# EAGLE design main_pcb (EAGLE 7.3.0)
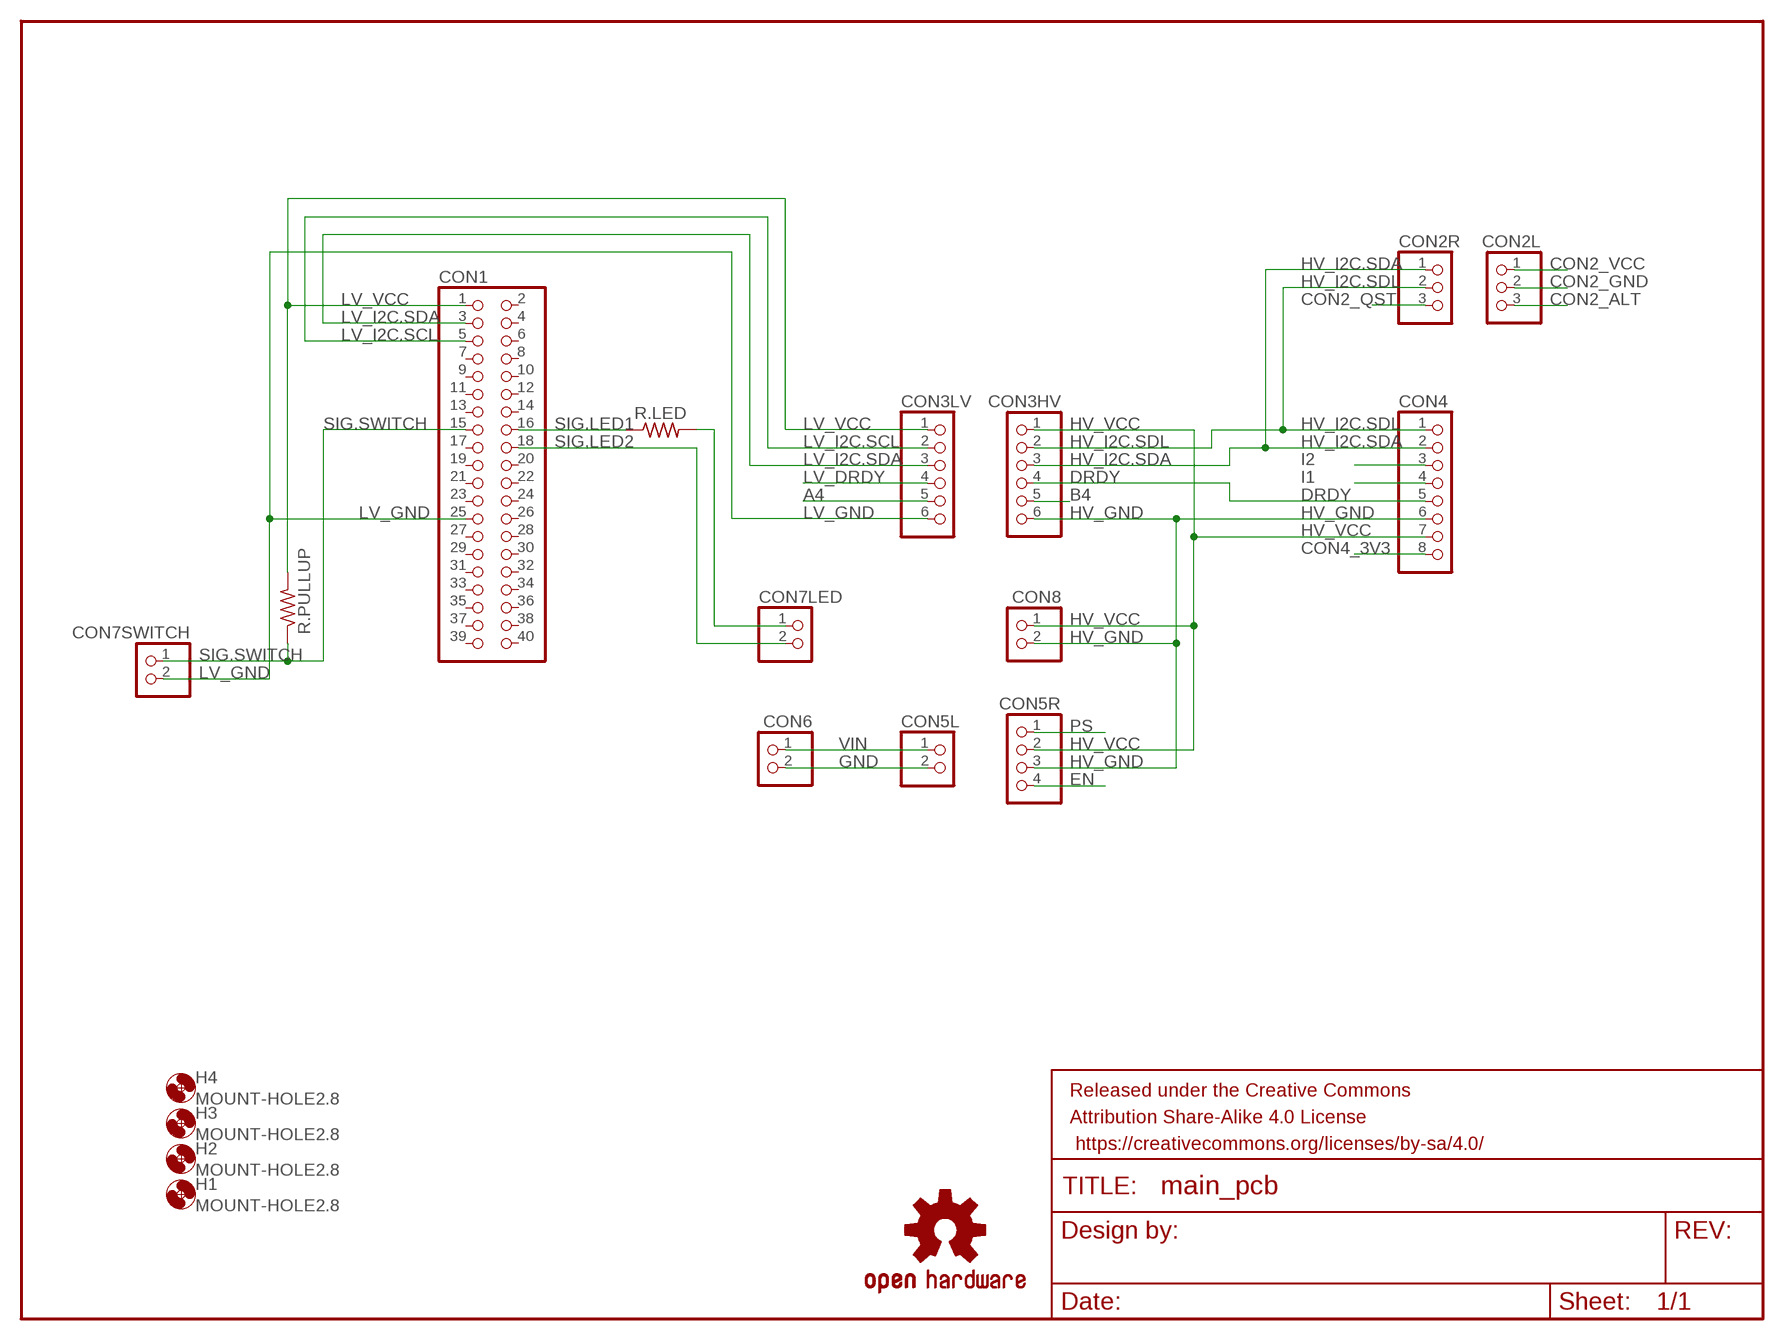
[diagram p0: schematic, sheet 1]

## Parts
CON1  PINHD-2X20  [2X20]
CON2L  PINHD-1X3  [1X03]
CON2R  PINHD-1X3  [1X03]
CON3HV  PINHD-1X6  [1X06]
CON3LV  PINHD-1X6  [1X06]
CON4  PINHD-1X8  [1X08]
CON5L  PINHD-1X2  [1X02]
CON5R  PINHD-1X4  [1X04]
CON6  PINHD-1X2  [1X02]
CON7LED  PINHD-1X2  [1X02]
CON7SWITCH  PINHD-1X2  [1X02]
CON8  PINHD-1X2  [1X02]
FRAME1  FRAME-LETTER  [CREATIVE_COMMONS]
H1  MOUNT-HOLE2.8  [2,8]
H2  MOUNT-HOLE2.8  [2,8]
H3  MOUNT-HOLE2.8  [2,8]
H4  MOUNT-HOLE2.8  [2,8]
LOGO1  OSHW-LOGOL  [OSHW-LOGO-L]
R.LED  R-US_0204/2V  [0204V]
R.PULLUP  R-US_0204/2V  [0204V]

## Nets
A4: CON3LV.5
B4: CON3HV.5
CON2_ALT: CON2L.3
CON2_GND: CON2L.2
CON2_QST: CON2R.3
CON2_VCC: CON2L.1
CON4_3V3: CON4.8
DRDY: CON3HV.4 CON4.5
EN: CON5R.4
GND: CON5L.2 CON6.2
HV_GND: CON3HV.6 CON4.6 CON5R.3 CON8.2
HV_I2C.SDA: CON2R.1 CON3HV.3 CON4.2
HV_I2C.SDL: CON2R.2 CON3HV.2 CON4.1
HV_VCC: CON3HV.1 CON4.7 CON5R.2 CON8.1
I1: CON4.4
I2: CON4.3
LV_DRDY: CON3LV.4
LV_GND: CON1.25 CON3LV.6 CON7SWITCH.2
LV_I2C.SCL: CON1.5 CON3LV.2
LV_I2C.SDA: CON1.3 CON3LV.3
LV_VCC: CON1.1 CON3LV.1 R.PULLUP.2
N$1: CON7LED.1 R.LED.2
PS: CON5R.1
SIG.LED1: CON1.16 R.LED.1
SIG.LED2: CON1.18 CON7LED.2
SIG.SWITCH: CON1.15 CON7SWITCH.1 R.PULLUP.1
VIN: CON5L.1 CON6.1
Unconnected: CON1.2 CON1.4 CON1.6 CON1.7 CON1.8 CON1.9 CON1.10 CON1.11 CON1.12 CON1.13 CON1.14 CON1.17 CON1.19 CON1.20 CON1.21 CON1.22 CON1.23 CON1.24 CON1.26 CON1.27 CON1.28 CON1.29 CON1.30 CON1.31 CON1.32 CON1.33 CON1.34 CON1.35 CON1.36 CON1.37 CON1.38 CON1.39 CON1.40

## Library data of the parts
CON1 = pinhead:PINHD-2X20: PIN HEADER
CON2L CON2R = pinhead:PINHD-1X3: PIN HEADER
CON3HV CON3LV = pinhead:PINHD-1X6: PIN HEADER
CON4 = pinhead:PINHD-1X8: PIN HEADER
CON5L CON6 CON7LED CON7SWITCH CON8 = pinhead:PINHD-1X2: PIN HEADER
CON5R = pinhead:PINHD-1X4: PIN HEADER
FRAME1 = SparkFun-Aesthetics:FRAME-LETTER: Schematic Frame Standard 8.5x11 US Letter frame
H1-H4 = holes:MOUNT-HOLE: MOUNTING HOLE with drill center marker
LOGO1 = SparkFun-Aesthetics:OSHW-LOGO: Open Source Hardware Logo This logo indicates the piece of hardware it is found on incorporates a OSHW license and/or adheres to the definition of open source hardware found here: http://freedomdefined.org/OSHW
R.LED R.PULLUP = resistor:R-US_: RESISTOR, American symbol

## Board
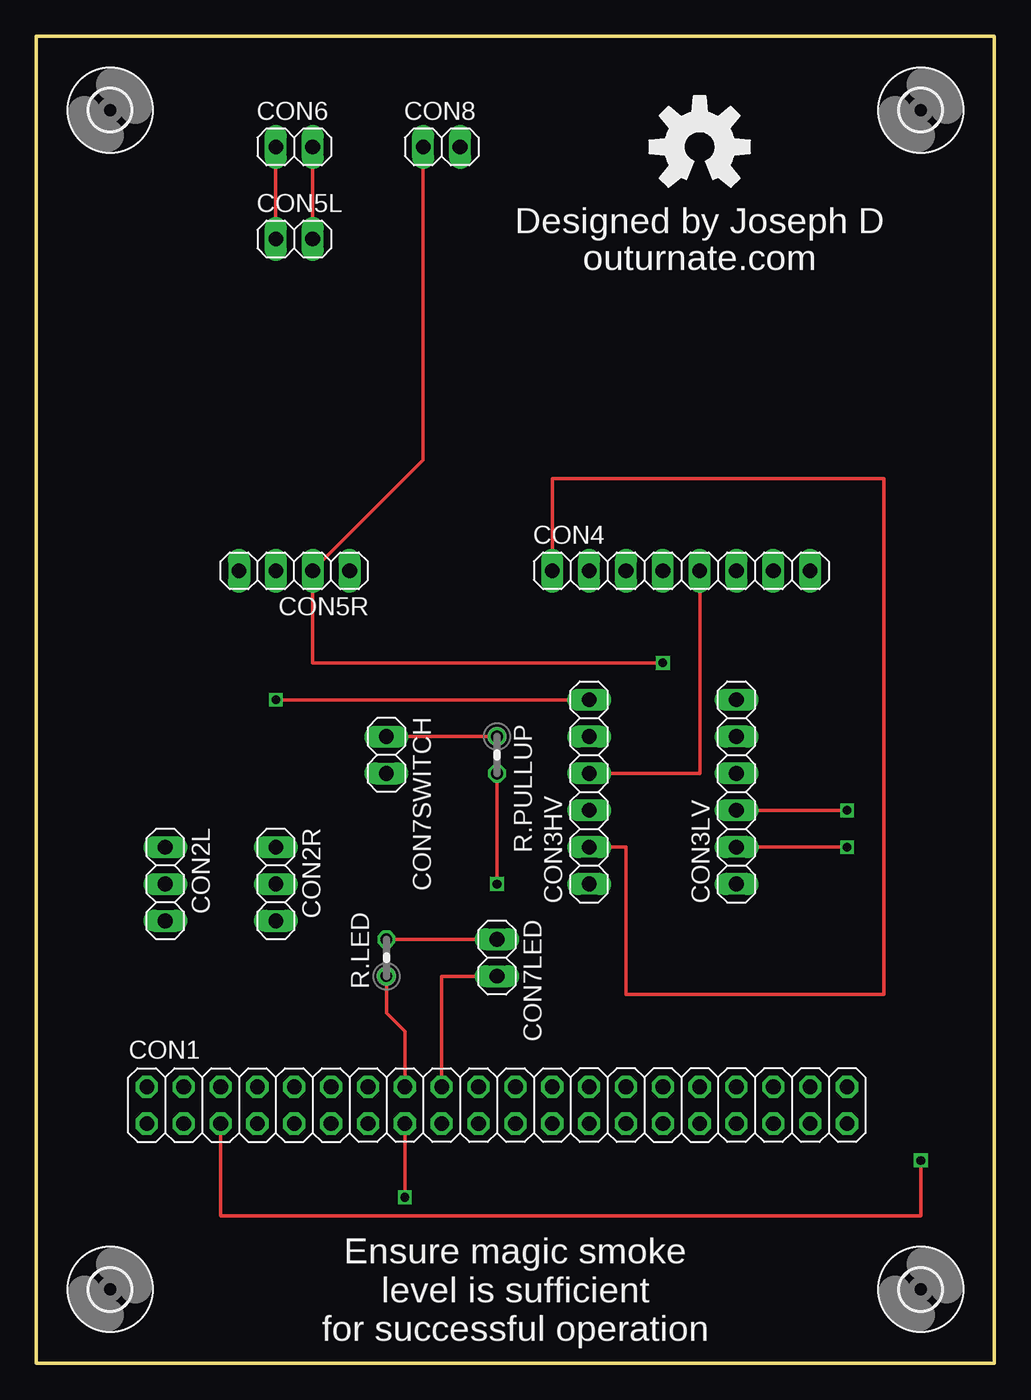
[diagram p1: board, top side]
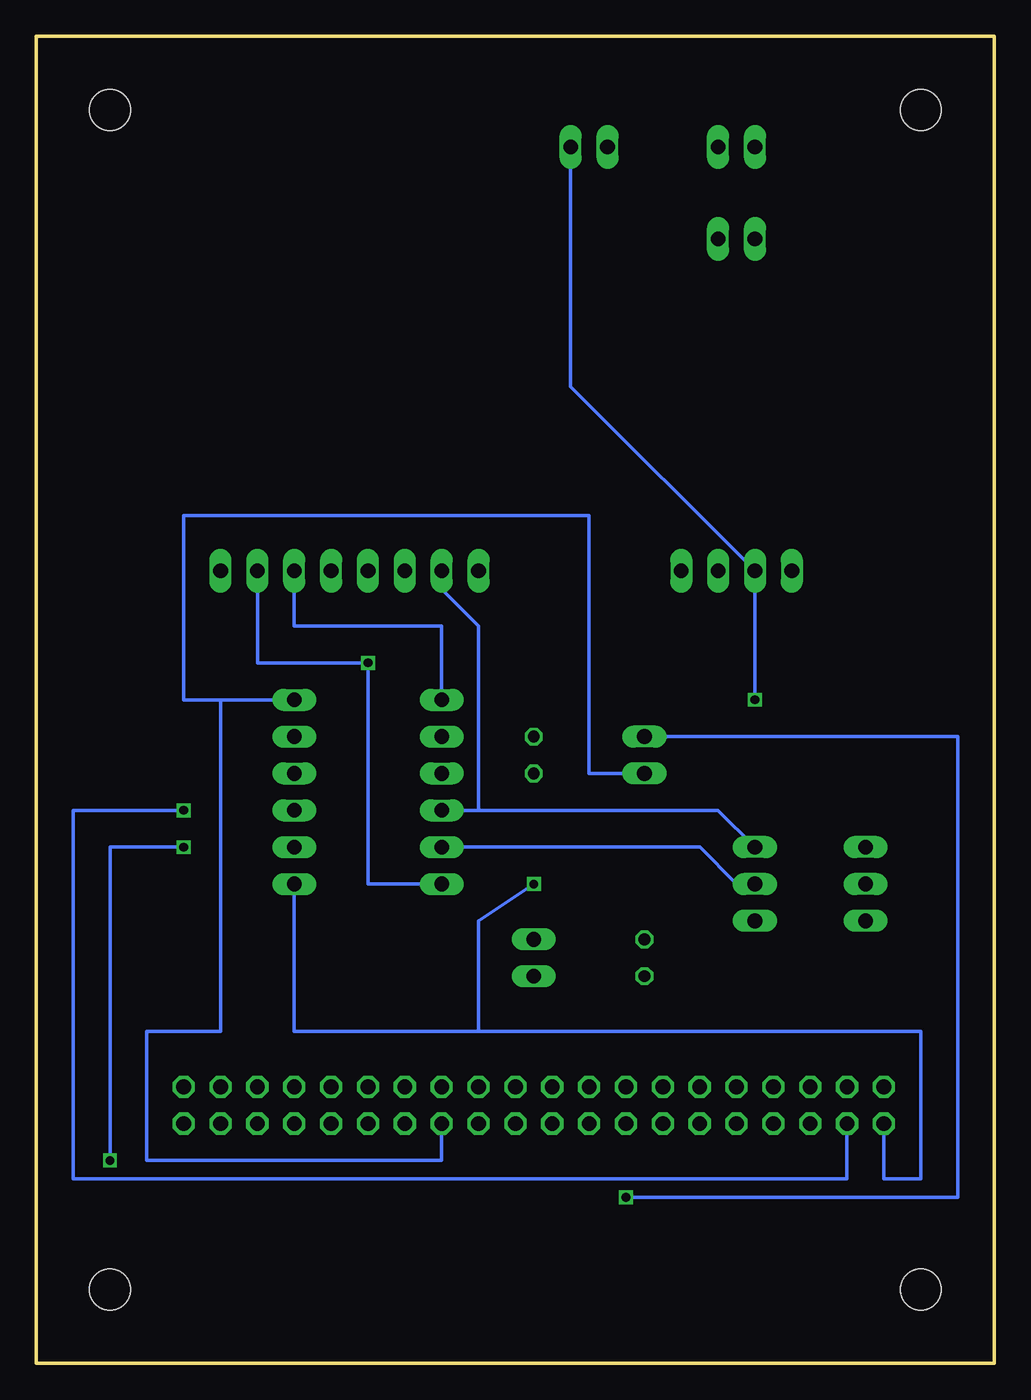
[diagram p2: board, bottom side, seen from below]

Size 66.04 x 91.44 mm. Coordinates in mm from the lower left corner, seen from the top.
Outline: 0,0 66.04,0 66.04,91.44 0,91.44 0,0
Copper layers (1*16): Top 0.0356mm / dielectric 1.5011mm / Bottom 0.0356mm
Design rules "LaenPCBOrder": minimum track width 6mil, minimum drill 13mil, track to track 6mil, track to pad 6mil, pad to pad 6mil, via to via 6mil, smd to smd 6mil, copper to edge 15mil, drill to drill 6mil, minimum pad ring 7mil, minimum via ring 7mil, stop-mask expansion 3mil, vias tented up to drill 0mil, thermal gap 10mil

### Footprints (pad centres in the part's own frame; a part is rotated, then mirrored left to right if it is on the bottom)
2X20 = drill 1.016 octagon: 1 -24.13,-1.27; 2 -24.13,1.27; 3 -21.59,-1.27; 4 -21.59,1.27; 5 -19.05,-1.27; 6 -19.05,1.27; 7 -16.51,-1.27; 8 -16.51,1.27; 9 -13.97,-1.27; 10 -13.97,1.27; 11 -11.43,-1.27; 12 -11.43,1.27; 13 -8.89,-1.27; 14 -8.89,1.27; 15 -6.35,-1.27; 16 -6.35,1.27; 17 -3.81,-1.27; 18 -3.81,1.27; 19 -1.27,-1.27; 20 -1.27,1.27; 21 1.27,-1.27; 22 1.27,1.27; 23 3.81,-1.27; 24 3.81,1.27; 25 6.35,-1.27; 26 6.35,1.27; 27 8.89,-1.27; 28 8.89,1.27; 29 11.43,-1.27; 30 11.43,1.27; 31 13.97,-1.27; 32 13.97,1.27; 33 16.51,-1.27; 34 16.51,1.27; 35 19.05,-1.27; 36 19.05,1.27; 37 21.59,-1.27; 38 21.59,1.27; 39 24.13,-1.27; 40 24.13,1.27
1X03 = drill 1.016 long: 1 -2.54,0; 2 0,0; 3 2.54,0
1X06 = drill 1.016 long: 1 -6.35,0; 2 -3.81,0; 3 -1.27,0; 4 1.27,0; 5 3.81,0; 6 6.35,0
1X08 = drill 1.016 long: 1 -8.89,0; 2 -6.35,0; 3 -3.81,0; 4 -1.27,0; 5 1.27,0; 6 3.81,0; 7 6.35,0; 8 8.89,0
1X02 = drill 1.016 long: 1 -1.27,0; 2 1.27,0
1X04 = drill 1.016 long: 1 -3.81,0; 2 -1.27,0; 3 1.27,0; 4 3.81,0
2,8 = hole 2.8: 0,0
0204V = drill 0.813 octagon: 1 -1.27,0; 2 1.27,0

### Placement (x,y rotation side)
CON1  31.75,17.78 0 top
CON2L  8.89,33.02 270 top
CON2R  16.51,33.02 270 top
CON3HV  38.1,39.37 90 top
CON3LV  48.26,39.37 90 top
CON4  44.45,54.61 0 top
CON5L  17.78,77.47 0 top
CON5R  17.78,54.61 180 top
CON6  17.78,83.82 0 top
CON7LED  31.75,27.94 270 top
CON7SWITCH  24.13,41.91 270 top
CON8  27.94,83.82 0 top
FRAME1  -91.44,-1.27 0 top  (outside the outline)
H1  5.08,5.08 0 top
H2  60.96,5.08 0 top
H3  5.08,86.36 0 top
H4  60.96,86.36 0 top
LOGO1  45.72,83.82 0 top
R.LED  24.13,27.94 90 top
R.PULLUP  31.75,41.91 270 top

### Tracks (layer width: path | path; a pad name or v marks a point on that pad's centre or on a via)
DRDY
  Top 0.254: CON4.5 45.72,40.64 CON3HV.4
GND
  Top 0.254: CON5L.2 CON6.2
HV_GND  (via drill 0.6)
  Top 0.254: v16.51,45.72 CON3HV.6
  Bottom 0.254: CON3HV.6 38.1,50.8 48.26,50.8 CON4.6 | v16.51,45.72 CON5R.3 29.21,67.31 CON8.2
HV_I2C.SDA
  Bottom 0.254: CON4.2 38.1,53.34 35.56,50.8 35.56,38.1 CON3HV.3 19.05,38.1 CON2R.1
HV_I2C.SDL
  Top 0.254: CON4.1 35.56,60.96 58.42,60.96 58.42,25.4 40.64,25.4 40.64,35.56 CON3HV.2
  Bottom 0.254: CON3HV.2 20.32,35.56 17.78,33.02 CON2R.2
HV_VCC  (via drill 0.6)
  Top 0.254: v43.18,48.26 19.05,48.26 CON5R.2 26.67,62.23 CON8.1
  Bottom 0.254: CON3HV.1 43.18,33.02 v43.18,48.26 50.8,48.26 CON4.7
LV_GND
  Bottom 0.254: CON3LV.6 53.34,45.72 | 53.34,45.72 53.34,22.86 58.42,22.86 58.42,13.97 38.1,13.97 CON1.25 | CON7SWITCH.2 27.94,40.64 27.94,58.42 55.88,58.42 55.88,45.72 53.34,45.72
LV_I2C.SCL  (via drill 0.6)
  Top 0.254: CON3LV.2 v55.88,35.56 | v60.96,13.97 60.96,10.16 12.7,10.16 CON1.5
  Bottom 0.254: v55.88,35.56 60.96,35.56 v60.96,13.97
LV_I2C.SDA  (via drill 0.6)
  Top 0.254: CON3LV.3 v55.88,38.1
  Bottom 0.254: v55.88,38.1 63.5,38.1 63.5,12.7 10.16,12.7 CON1.3
LV_VCC  (via drill 0.6)
  Top 0.254: R.PULLUP.2 v31.75,33.02
  Bottom 0.254: CON3LV.1 48.26,22.86 35.56,22.86 | 35.56,22.86 5.08,22.86 5.08,12.7 7.62,12.7 CON1.1 | v31.75,33.02 35.56,30.48 35.56,22.86
N$1
  Top 0.254: R.LED.2 CON7LED.1
SIG.LED1
  Top 0.254: R.LED.1 24.13,24.13 25.4,22.86 CON1.16
SIG.LED2
  Top 0.254: CON7LED.2 27.94,26.67 CON1.18
SIG.SWITCH  (via drill 0.6)
  Top 0.254: CON1.15 v25.4,11.43 | CON7SWITCH.1 R.PULLUP.1
  Bottom 0.254: v25.4,11.43 2.54,11.43 2.54,43.18 CON7SWITCH.1
VIN
  Top 0.254: CON5L.1 CON6.1

### Text on the board
tPlace: Designed by Joseph D | outurnate.com | Ensure magic smoke / level is sufficient / for successful operation